# EAGLE design untitled (EAGLE 7.4.0)
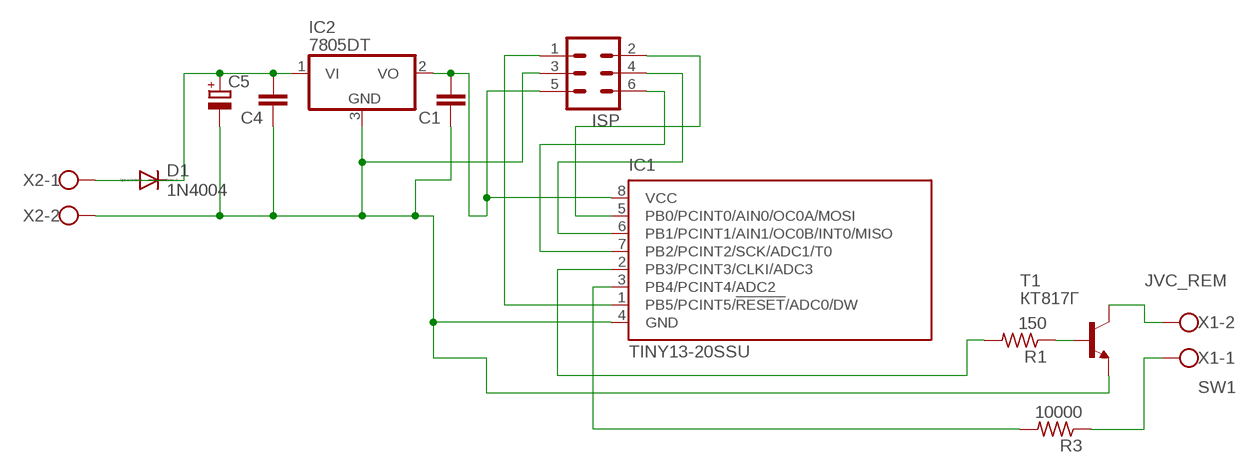
[diagram p0: schematic, sheet 1]

## Parts
C1  C2.5/2  [C2.5-2]
C4  C2.5/2  [C2.5-2]
C5  CPOL-EUE5-10.5  [E5-10,5]
D1  1N4004  [DO41-10]
IC1  TINY13-20SSU  [8S1]
IC2  7805DT  [TO252]
ISP  MA03-2  [MA03-2]
R1  150  R-US_M1206  [M1206]
R3  10000  R-US_M1206  [M1206]
T1  КТ817Г  2SC1307  [TO220AV]
X1  W237-102  [W237-102]
X2  W237-102  [W237-102]

## Nets
JVC_REM: T1.2(C) X1.2
N$1: IC1.2(PB3/PCINT3/CLKI/ADC3) R1.2
N$2: C4.2 C5.+ D1.A IC2.1(VI)
N$3: IC1.6(PB1/PCINT1/AIN1/OC0B/INT0/MISO) ISP.4
N$4: C1.1 C4.1 C5.- IC1.4(GND) IC2.3(GND) ISP.3 T1.3(E) X2.2
N$5: R1.1 T1.1(B)
N$6: IC1.7(PB2/PCINT2/SCK/ADC1/T0) ISP.6
N$7: D1.C X2.1
N$8: IC1.5(PB0/PCINT0/AIN0/OC0A/MOSI) ISP.2
N$10: IC1.3(PB4/PCINT4/ADC2) R3.2
N$11: IC1.1(PB5/PCINT5/!RESET!/ADC0/DW) ISP.1
N$12: C1.2 IC1.8(VCC) IC2.2(VO) ISP.5
SW1: R3.1 X1.1

## Library data of the parts
C1 C4 = capacitor-wima:C: CAPACITOR naming: grid - package width
C5 = resistor:CPOL-EU: POLARIZED CAPACITOR, European symbol
D1 = diode:1N4004: DIODE general purpose rectifier, 1 A
IC1 = atmel:TINY13: 8-bit AVR Microcontroller with 1K Bytes In-System Programmable Flash Source: http://www.atmel.com/dyn/resources/prod_documents/2535S.pdf; MPN: ATTINY13-20SSU; OC_FARNELL: 1455133; OC_NEWARK: 58M3771
IC2 = linear:78*: Positive VOLTAGE REGULATOR Source: http://cache.national.com/ds/LM/LM78L05.pdf http://www.fairchildsemi.com/ds/LM/LM7805.pdf
ISP = con-lstb:MA03-2: PIN HEADER; OC_FARNELL: unknown; OC_NEWARK: unknown
R1 R3 = resistor:R-US_: RESISTOR, American symbol
T1 = transistor:2SC1307: NPN Transistor Silicon Epitaxial, High Frequency Power Amplifier Source: 2SC1307.pdf
X1 X2 = con-wago-500:W237-102: WAGO SCREW CLAMP; MPN: 237-102; OC_FARNELL: unknown; OC_NEWARK: 70K9898

## Net classes
0 default: width 0.457 mm

## Board
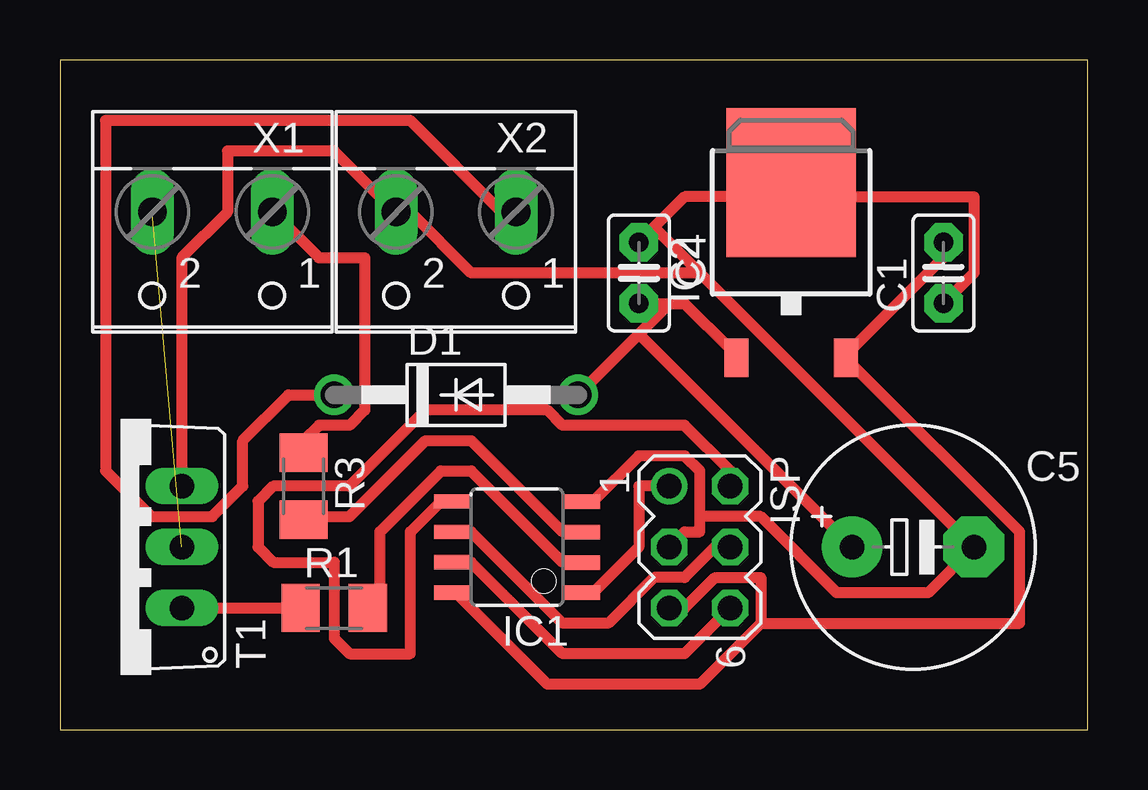
[diagram p1: board, top side]

Size 42.85 x 27.93 mm. Coordinates in mm from the lower left corner, seen from the top.
Outline: 0,0 42.85,0 42.85,27.93 0,27.93 0,0
Copper layers (1*16): Top 0.035mm / dielectric 1.5mm / Bottom 0.035mm
Design rules "default": minimum track width 10mil, minimum drill 24mil, track to track 8mil, track to pad 8mil, pad to pad 8mil, via to via 8mil, smd to smd 8mil, copper to edge 40mil, drill to drill 8mil, minimum pad ring 10mil, minimum via ring 8mil, stop-mask expansion 4mil, vias tented up to drill 0mil, thermal gap 10mil

### Footprints (pad centres in the part's own frame; a part is rotated, then mirrored left to right if it is on the bottom)
C2.5-2 = drill 0.813 pad 1.6 octagon: 1 -1.27,0; 2 1.27,0
E5-10,5 = drill 1.016 pad 2.54: + -2.54,0 | drill 1.016 pad 2.54 octagon: - 2.54,0
DO41-10 = drill 1.118: A 5.08,0; C -5.08,0
8S1 = smd 0.6 x 1.6: 1 -1.905,-2.654; 2 -0.645,-2.654; 3 0.625,-2.654; 4 1.895,-2.654; 5 1.905,2.654; 6 0.635,2.654; 7 -0.635,2.654; 8 -1.905,2.654
TO252 = smd 1 x 1.6: 1 -2.28,-4.8; 2 2.28,-4.8 | smd 5.4 x 6.2: 3 0,2.5
MA03-2 = drill 1.016: 1 -2.54,-1.27 | drill 1.016 octagon: 2 -2.54,1.27; 3 0,-1.27; 4 0,1.27; 5 2.54,-1.27; 6 2.54,1.27
M1206 = smd 1.6 x 2: 1 -1.4,0; 2 1.4,0
TO220AV = drill 1.016 long: 1 -2.54,-2.54; 2 0,-2.54; 3 2.54,-2.54
W237-102 = drill 1.194 long: 1 -2.5,-1.27; 2 2.5,-1.27

### Placement (x,y rotation side)
C1  36.83,19.05 90 top
C4  24.13,19.05 270 top
C5  35.56,7.62 0 top
D1  16.51,13.97 0 top
IC1  19.05,7.62 90 top
IC2  30.48,20.32 0 top
ISP  26.67,7.62 270 top
R1  11.43,5.08 0 top
R3  10.16,10.16 270 top
T1  2.54,7.62 90 top
X1  6.35,20.32 180 top
X2  16.51,20.32 180 top

### Tracks (layer width: path | path; a pad name or v marks a point on that pad's centre or on a via)
JVC_REM  (1 unrouted)
N$1
  Top 0.457: IC1.2 21.59,6.98 20.95,6.98 17.14,10.8 15.88,10.8 13.34,8.26 13.34,5.08 R1.2
N$2
  Top 0.457: C4.2 25.4,17.78 | 25.4,17.78 26.04,17.78 27.94,15.88 IC2.1 | 25.4,17.78 24.13,16.51 | 24.13,16.51 D1.A | 24.13,16.51 C5.+
N$3
  Top 0.457: IC1.6 17.14,8.26 20.95,4.45 22.86,4.45 24.77,6.35 26.04,6.35 27.3,7.62 ISP.4
N$4
  Top 0.457: T1.3 5.08,19.69 6.98,21.59 6.98,24.13 11.43,24.13 13.97,21.59 X2.2 14.61,21.59 17.14,19.05 26.67,19.05 | 26.67,8.89 26.67,8.26 26.04,8.26 ISP.3 | 26.67,8.89 26.67,10.8 26.04,11.43 24.13,11.43 22.23,9.53 IC1.4 | 26.67,8.89 29.21,8.89 32.38,5.72 36.2,5.72 C5.- 26.67,19.05 | 24.77,20.95 26.04,22.23 30.48,22.23 | 24.77,20.95 C4.1 | C1.1 38.1,19.05 38.1,22.23 30.48,22.23 | 30.48,22.23 IC2.3 | 24.77,20.95 26.67,19.05
N$5
  Top 0.457: T1.1 R1.1
N$6
  Top 0.457: IC1.7 17.14,6.98 20.95,3.18 26.04,3.18 ISP.6
N$7
  Top 0.457: D1.C 9.52,13.97 7.62,12.07 7.62,10.16 6.35,8.89 3.81,8.89 1.91,10.8 1.91,25.4 14.61,25.4 18.41,21.59 X2.1
N$8
  Top 0.457: ISP.2 27.94,10.8 26.04,12.7 20.95,12.7 20.32,13.34 15.24,13.34 12.07,10.16 8.89,10.16 8.25,9.53 8.25,7.62 8.89,6.98 11.43,6.98 11.43,3.81 12.07,3.18 14.61,3.18 14.61,8.26 15.88,9.53 IC1.5
N$10
  Top 0.457: IC1.3 21.59,8.26 20.95,8.26 17.14,12.07 15.24,12.07 12.07,8.89 10.16,8.89 R3.2
N$11
  Top 0.457: ISP.1 24.13,10.16 24.13,7.62 22.23,5.72 IC1.1
N$12
  Top 0.457: C1.2 36.83,19.69 33.02,15.88 IC2.2 33.02,15.24 40.01,8.26 40.01,4.45 29.21,4.45 | 29.21,4.45 26.67,1.91 20.32,1.91 16.51,5.72 IC1.8 | 29.21,4.45 29.21,6.35 27.3,6.35 26.04,5.08 ISP.5
SW1
  Top 0.457: R3.1 10.16,12.07 10.8,12.7 12.07,12.7 12.7,13.34 12.7,19.69 10.8,19.69 8.89,21.59 X1.1